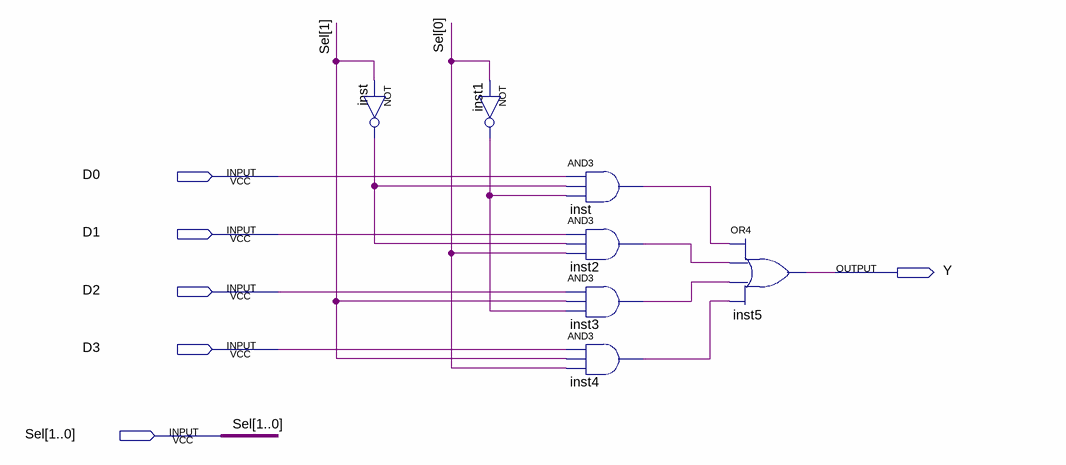
[diagram p0: schematic sheet]
// Quartus schematic mux4_1_1bit.bdf as structural Verilog: 7 symbols, 6 pins
module mux4_1_1bit (
  input  D0,
  input  D1,
  input  D2,
  input  D3,
  input  [1:0] Sel,
  output Y
);

  wire inst1_out, inst2_out, inst3_out, inst4_out, inst_out, inst_out_2;

  not inst (inst_out_2, Sel[1]);
  not inst1 (inst1_out, Sel[0]);
  and inst_dup2 (inst_out, D0, inst_out_2, inst1_out);
  and inst2 (inst2_out, D1, inst_out_2, Sel[0]);
  and inst3 (inst3_out, D2, Sel[1], inst1_out);
  and inst4 (inst4_out, D3, Sel[1], Sel[0]);
  or inst5 (Y, inst_out, inst2_out, inst3_out, inst4_out);
endmodule
